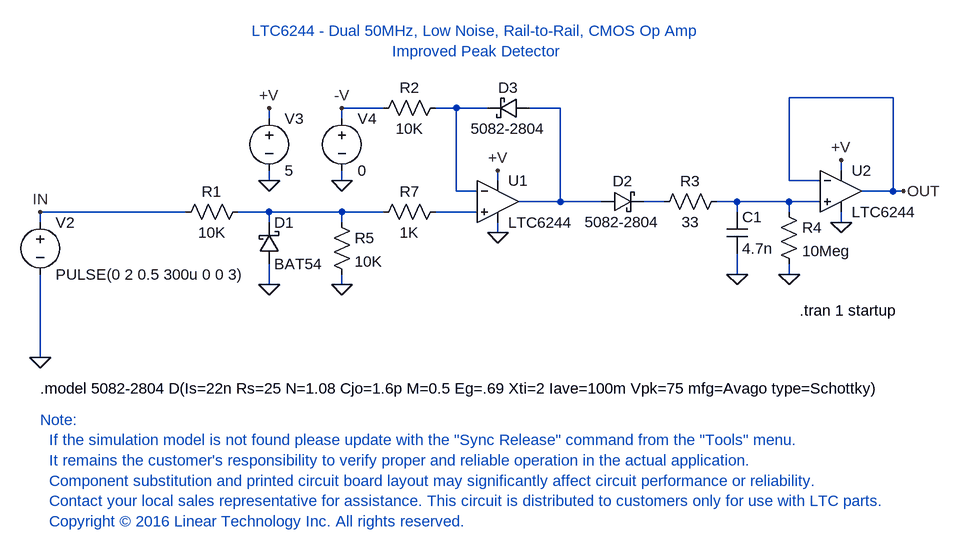
[diagram p0: schematic phototransistor-peak-alt.asc]
phototransistor-peak-alt.asc, the LTspice schematic file:
Version 4
SHEET 1 880 1712
WIRE -768 0 -928 0
WIRE -1552 16 -1616 16
WIRE -1440 16 -1472 16
WIRE -1392 16 -1440 16
WIRE -1280 16 -1328 16
WIRE -1728 32 -1728 16
WIRE -1616 32 -1616 16
WIRE -848 112 -848 96
WIRE -1728 128 -1728 112
WIRE -1616 128 -1616 112
WIRE -1376 128 -1376 112
WIRE -928 128 -928 0
WIRE -880 128 -928 128
WIRE -1440 144 -1440 16
WIRE -1408 144 -1440 144
WIRE -768 144 -768 0
WIRE -768 144 -816 144
WIRE -752 144 -768 144
WIRE -1280 160 -1280 16
WIRE -1280 160 -1344 160
WIRE -1216 160 -1280 160
WIRE -1120 160 -1152 160
WIRE -1008 160 -1040 160
WIRE -928 160 -1008 160
WIRE -880 160 -928 160
WIRE -1856 176 -2080 176
WIRE -1728 176 -1776 176
WIRE -1616 176 -1728 176
WIRE -1552 176 -1616 176
WIRE -1408 176 -1472 176
WIRE -1008 176 -1008 160
WIRE -928 176 -928 160
WIRE -2080 192 -2080 176
WIRE -1728 192 -1728 176
WIRE -1616 192 -1616 176
WIRE -848 192 -848 176
WIRE -1376 208 -1376 192
WIRE -1008 272 -1008 240
WIRE -928 272 -928 256
WIRE -1728 288 -1728 256
WIRE -1616 288 -1616 272
WIRE -2080 400 -2080 272
FLAG -2080 400 0
FLAG -2080 176 IN
FLAG -1376 208 0
FLAG -1376 112 +V
FLAG -1728 288 0
FLAG -1616 288 0
FLAG -1008 272 0
FLAG -928 272 0
FLAG -848 192 0
FLAG -752 144 OUT
FLAG -1616 128 0
FLAG -1616 16 -V
FLAG -1728 128 0
FLAG -848 96 +V
FLAG -1728 16 +V
SYMBOL voltage -2080 176 R0
WINDOW 123 0 0 Left 2
WINDOW 39 0 0 Left 2
SYMATTR InstName V2
SYMATTR Value PULSE(0 2 0.5 300u 0 0 3)
SYMBOL res -1872 192 R270
WINDOW 0 32 56 VTop 2
WINDOW 3 0 56 VBottom 2
SYMATTR InstName R1
SYMATTR Value 10K
SYMBOL LTC6244 -1376 160 R0
SYMATTR InstName U1
SYMBOL cap -1024 176 R0
SYMATTR InstName C1
SYMATTR Value 4.7n
SYMBOL res -1456 0 R90
WINDOW 0 0 56 VBottom 2
WINDOW 3 32 56 VTop 2
SYMATTR InstName R2
SYMATTR Value 10K
SYMBOL res -1136 176 R270
WINDOW 0 32 56 VTop 2
WINDOW 3 0 56 VBottom 2
SYMATTR InstName R3
SYMATTR Value 33
SYMBOL res -944 160 R0
SYMATTR InstName R4
SYMATTR Value 10Meg
SYMBOL schottky -1744 256 M180
WINDOW 0 24 64 Left 2
WINDOW 3 24 0 Left 2
SYMATTR InstName D1
SYMATTR Value BAT54
SYMATTR Description Diode
SYMATTR Type diode
SYMBOL schottky -1216 176 R270
WINDOW 0 32 32 VTop 2
WINDOW 3 0 32 VBottom 2
SYMATTR InstName D2
SYMATTR Value 5082-2804
SYMATTR Description Diode
SYMATTR Type diode
SYMBOL schottky -1328 0 R90
WINDOW 0 0 32 VBottom 2
WINDOW 3 32 32 VTop 2
SYMATTR InstName D3
SYMATTR Value 5082-2804
SYMATTR Description Diode
SYMATTR Type diode
SYMBOL res -1632 176 R0
SYMATTR InstName R5
SYMATTR Value 10K
SYMBOL LTC6244 -848 144 R0
SYMATTR InstName U2
SYMBOL res -1568 192 R270
WINDOW 0 32 56 VTop 2
WINDOW 3 0 56 VBottom 2
SYMATTR InstName R7
SYMATTR Value 1K
SYMBOL voltage -1728 16 R0
WINDOW 123 0 0 Left 2
WINDOW 39 0 0 Left 2
SYMATTR InstName V3
SYMATTR Value 5
SYMBOL voltage -1616 16 R0
WINDOW 123 0 0 Left 2
WINDOW 39 0 0 Left 2
SYMATTR InstName V4
SYMATTR Value 0
TEXT -2080 448 Left 2 !.model 5082-2804 D(Is=22n Rs=25 N=1.08 Cjo=1.6p M=0.5 Eg=.69 Xti=2 Iave=100m Vpk=75 mfg=Avago type=Schottky)
TEXT -912 328 Left 2 !.tran 1 startup
TEXT -1408 -56 Bottom 2 ;LTC6244 - Dual 50MHz, Low Noise, Rail-to-Rail, CMOS Op Amp\nImproved Peak Detector
TEXT -2080 496 Left 2 ;Note:\n  If the simulation model is not found please update with the "Sync Release" command from the "Tools" menu.\n  It remains the customer's responsibility to verify proper and reliable operation in the actual application.\n  Component substitution and printed circuit board layout may significantly affect circuit performance or reliability.\n  Contact your local sales representative for assistance. This circuit is distributed to customers only for use with LTC parts.\n  Copyright © 2016 Linear Technology Inc. All rights reserved.

The netlist it stands for:
* phototransistor-peak-alt.asc
V2 IN 0 PULSE(0 2 0.5 300u 0 0 3)
R1 IN N005 10K
XU1 N006 N001 +V 0 N002 LTC6244  ; pins In+ In- V+ V- OUT
C1 N004 0 4.7n
R2 N001 -V 10K
R3 N003 N004 33
R4 N004 0 10Meg
D1 0 N005 BAT54
D2 N002 N003 5082-2804
D3 N002 N001 5082-2804
R5 N005 0 10K
XU2 N004 OUT +V 0 OUT LTC6244  ; pins In+ In- V+ V- OUT
R7 N005 N006 1K
V3 +V 0 5
V4 -V 0 0
.model D D
.lib standard.dio
.model 5082-2804 D(Is=22n Rs=25 N=1.08 Cjo=1.6p M=0.5 Eg=.69 Xti=2 Iave=100m Vpk=75 mfg=Avago type=Schottky)
.tran 1 startup
* LTC6244 - Dual 50MHz, Low Noise, Rail-to-Rail, CMOS Op Amp
* Improved Peak Detector
* Note:
*   If the simulation model is not found please update with the "Sync Release" command from the "Tools" menu.
*   It remains the customer's responsibility to verify proper and reliable operation in the actual application.
*   Component substitution and printed circuit board layout may significantly affect circuit performance or reliability.
*   Contact your local sales representative for assistance. This circuit is distributed to customers only for use with LTC parts.
*   Copyright © 2016 Linear Technology Inc. All rights reserved.
.backanno
.end